# EAGLE design stimmopped (EAGLE 4.16)
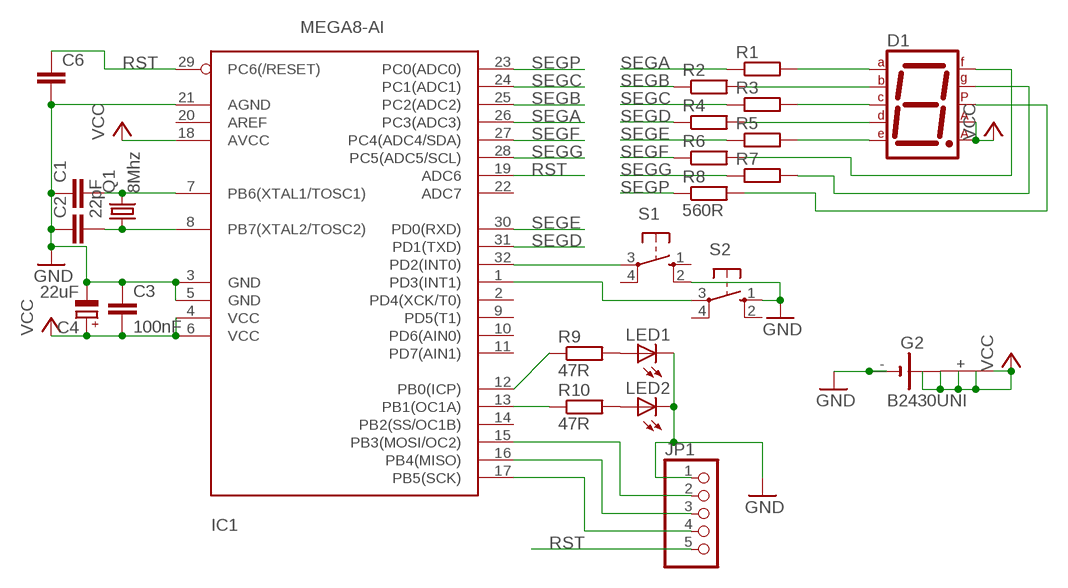
[diagram p0: schematic, sheet 1]

## Parts
C1  C-EUC0805K  [C0805K]
C2  22pF  C-EUC0805K  [C0805K]
C3  100nF  C-EUC0805K  [C0805K]
C4  22uF  CPOL-EUCT7343  [CT7343]
C6  C-EUC0805K  [C0805K]
D1  7SEG-MCA  [7SEG-7]
G2  B2430UNI  [B2430UNI]
IC1  MEGA8-AI  [TQFP32-08]
JP1  PINHD-1X5  [1X05]
LED1  LED5MM  [LED5MM]
LED2  LED5MM  [LED5MM]
Q1  8Mhz  CRYSTALHC49U-V  [HC49U-V]
R1  R-EU_R0805  [R0805]
R2  R-EU_R0805  [R0805]
R3  R-EU_R0805  [R0805]
R4  R-EU_R0805  [R0805]
R5  R-EU_R0805  [R0805]
R6  R-EU_R0805  [R0805]
R7  R-EU_R0805  [R0805]
R8  560R  R-EU_R0805  [R0805]
R9  47R  R-EU_R0805  [R0805]
R10  47R  R-EU_R0805  [R0805]
S1  10-XX  [B3F-10XX]
S2  10-XX  [B3F-10XX]

## Nets
GND: C1.1 C2.1 C3.1 C4.- C6.2 G2.- G2.-@1(-) IC1.3(GND) IC1.5(GND) IC1.21(AGND) JP1.1 LED1.K(C) LED2.K(C) S1.2(S1) S2.1(S)
N$1: D1.9(B) R2.2
N$2: C2.2 IC1.8(PB7(XTAL2/TOSC2)) Q1.1
N$3: C1.2 IC1.7(PB6(XTAL1/TOSC1)) Q1.2
N$6: D1.5(D) R4.2
N$8: D1.2(F) R6.2
N$9: D1.3(G) R7.2
N$10: D1.7(DP) R8.2
N$11: D1.10(A) R1.2
N$13: D1.8(C) R3.2
N$14: D1.4(E) R5.2
N$20: IC1.15(PB3(MOSI/OC2)) JP1.2
N$21: IC1.16(PB4(MISO)) JP1.3
N$22: IC1.17(PB5(SCK)) JP1.4
N$23: IC1.12(PB0(ICP)) R9.1
N$24: IC1.13(PB1(OC1A)) R10.1
N$25: IC1.32(PD2(INT0)) S1.3(P)
N$26: IC1.1(PD3(INT1)) S2.3(P)
N$28: LED1.A R9.2
N$29: LED2.A R10.2
RST: C6.1 IC1.19(ADC6) IC1.29(PC6(/RESET)) JP1.5
SEGA: IC1.26(PC3(ADC3)) R1.1
SEGB: IC1.25(PC2(ADC2)) R2.1
SEGC: IC1.24(PC1(ADC1)) R3.1
SEGD: IC1.31(PD1(TXD)) R4.1
SEGE: IC1.30(PD0(RXD)) R5.1
SEGF: IC1.27(PC4(ADC4/SDA)) R6.1
SEGG: IC1.28(PC5(ADC5/SCL)) R7.1
SEGP: IC1.23(PC0(ADC0)) R8.1
VCC: C3.2 C4.+ D1.1(CA1) D1.6(CA2) G2.+ G2.+@1(+) G2.+@2(+) G2.+@3(+) G2.+@4(+) IC1.4(VCC) IC1.6(VCC) IC1.18(AVCC)
Unconnected: IC1.2(PD4(XCK/T0)) IC1.9(PD5(T1)) IC1.10(PD6(AIN0)) IC1.11(PD7(AIN1)) IC1.14(PB2(SS/OC1B)) IC1.20(AREF) IC1.22(ADC7) S1.1(S) S1.4(P1) S2.2(S1) S2.4(P1)

## Library data of the parts
C1-C3 C6 = rcl:C-EU: CAPACITOR, European symbol
C4 = rcl:CPOL-EU: POLARIZED CAPACITOR, European symbol
D1 = special:7SEG-MCA: 7-segment DISPLAY single anode, 13 mm
G2 = battery:B2430UNI: LI BATTERY
IC1 = atmel:MEGA8: MICROCONTROLLER 8 Kbytes FLASH 1 kbytes SRAM 512 bytes EEPROM USART 6-channel 10 bit ADC 2-channel 8 bit ADC Source: avr.lbr
JP1 = pinhead:PINHD-1X5: PIN HEADER
LED1 LED2 = led:LED: LED OSRAM: - CHIPLED LG R971, LG N971, LY N971, LG Q971, LY Q971, LO R971, LY R971 LH N974, LH R974 LS Q976, LO Q976, LY Q976 LO Q996 - Hyper CHIPLED LW Q18S LB Q993, LB Q99A, LB R99A - SideLED LS A670, LO A670, LY A670, LG A670, LP A670 LB A673, LV A673, LT A673, LW A673 LH A674 LY A675 LS A676, LA A676, LO A676, LY A676, LW A676 LS A679, LY A679, LG A679 - Hyper Micro SIDELED® LS Y876, LA Y876, LO Y876, LY Y876 LT Y87S - SmartLED LW L88C, LW L88S LB L89C, LB L89S, LG L890 LS L89K, LO L89K, LY L89K LS L896, LA L896, LO L896, LY L896 - TOPLED LS T670, LO T670, LY T670, LG T670, LP T670 LSG T670, LSP T670, LSY T670, LOP T670, LYG T670 LG T671, LOG T671, LSG T671 LB T673, LV T673, LT T673, LW T673 LH T674 LS T676, LA T676, LO T676, LY T676, LB T676, LH T676, LSB T676, LW T676 LB T67C, LV T67C, LT T67C, LS T67K, LO T67K, LY T67K, LW E67C LS E67B, LA E67B, LO E67B, LY E67B, LB E67C, LV E67C, LT E67C LW T67C LS T679, LY T679, LG T679 LS T770, LO T770, LY T770, LG T770, LP T770 LB T773, LV T773, LT T773, LW T773 LH T774 LS E675, LA E675, LY E675, LS T675 LS T776, LA T776, LO T776, LY T776, LB T776 LHGB T686 LT T68C, LB T68C - Hyper Mini TOPLED® LB M676 - Mini TOPLED Santana® LG M470 LS M47K, LO M47K, LY M47K Source: http://www.osram.convergy.de - LUMILED® LXK2-PW12-R00, LXK2-PW12-S00, LXK2-PW14-U00, LXK2-PW14-V00 LXK2-PM12-R00, LXK2-PM12-S00, LXK2-PM14-U00 LXK2-PE12-Q00, LXK2-PE12-R00, LXK2-PE12-S00, LXK2-PE14-T00, LXK2-PE14-U00 LXK2-PB12-K00, LXK2-PB12-L00, LXK2-PB12-M00, LXK2-PB14-N00, LXK2-PB14-P00, LXK2-PB14-Q00 LXK2-PR12-L00, LXK2-PR12-M00, LXK2-PR14-Q00, LXK2-PR14-R00 LXK2-PD12-Q00, LXK2-PD12-R00, LXK2-PD12-S00 LXK2-PH12-R00, LXK2-PH12-S00 LXK2-PL12-P00, LXK2-PL12-Q00, LXK2-PL12-R00 Source: www.luxeon.com
Q1 = crystal:CRYSTAL: CRYSTAL
R1-R10 = rcl:R-EU_: RESISTOR, European symbol
S1 S2 = switch-omron:10-XX: OMRON SWITCH

## Board
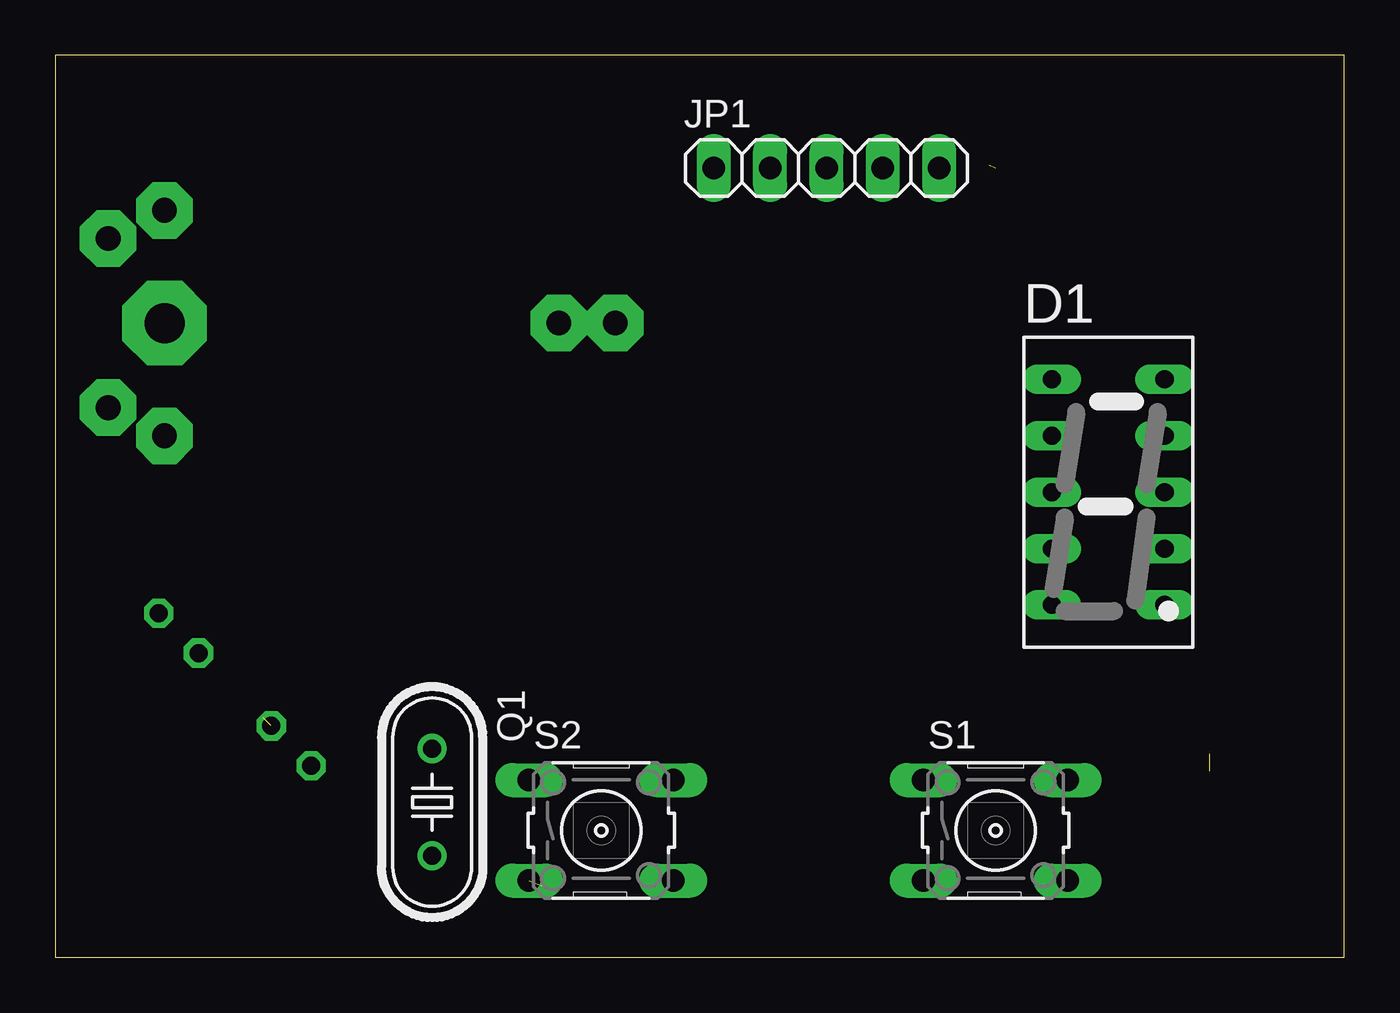
[diagram p1: board, top side]
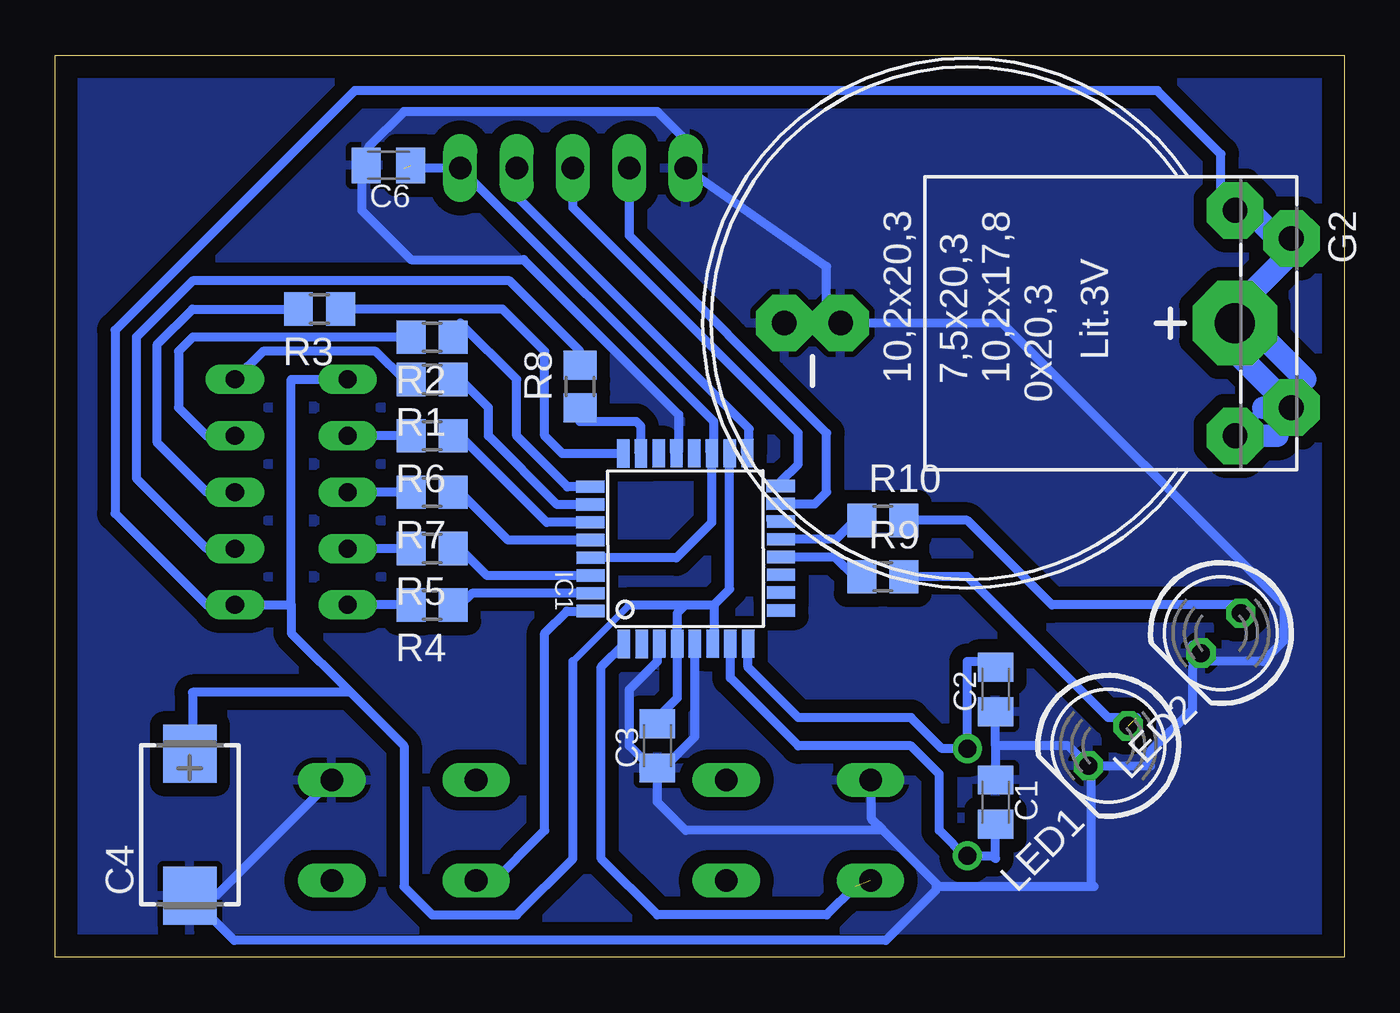
[diagram p2: board, bottom side, seen from below]

Size 58.09 x 40.63 mm. Coordinates in mm from the lower left corner, seen from the top.
Outline: 0,0 58.09,0 58.09,40.63 0,40.63 0,0
Copper layers (1*16): Top 0.035mm / dielectric 1.5mm / Bottom 0.035mm
Design rules "default": minimum track width 10mil, minimum drill 24mil, track to track 8mil, track to pad 8mil, pad to pad 8mil, via to via 8mil, smd to smd 8mil, copper to edge 40mil, drill to drill 8mil, minimum pad ring 10mil, minimum via ring 8mil, stop-mask expansion 4mil, vias tented up to drill 0mil, thermal gap 10mil

### Footprints (pad centres in the part's own frame; a part is rotated, then mirrored left to right if it is on the bottom)
C0805K = smd 1.3 x 1.6: 1 -1,0; 2 1,0
CT7343 = smd 2.6 x 2.4: + 3.2,0; - -3.2,0
7SEG-7 = drill 0.813 long: 1 -2.54,5.08; 2 -2.54,2.54; 3 -2.54,0; 4 -2.54,-2.54; 5 -2.54,-5.08; 6 2.54,-5.08; 7 2.54,-2.54; 8 2.54,0; 9 2.54,2.54; 10 2.54,5.08
B2430UNI = drill 1.118 pad 2.54 octagon: + 3.81,14.605; +@1 -3.81,14.605; +@2 -5.08,12.065; +@3 5.08,12.065; - 0,-5.715; -@1 0,-8.255 | drill 1.803 pad 3.81 octagon: +@4 0,12.065
TQFP32-08 = smd 1.27 x 0.559: 1 -4.293,2.8; 2 -4.293,2; 3 -4.293,1.2; 4 -4.293,0.4; 5 -4.293,-0.4; 6 -4.293,-1.2; 7 -4.293,-2; 8 -4.293,-2.8; 17 4.293,-2.8; 18 4.293,-2; 19 4.293,-1.2; 20 4.293,-0.4; 21 4.293,0.4; 22 4.293,1.2; 23 4.293,2; 24 4.293,2.8 | smd 0.559 x 1.27: 9 -2.8,-4.293; 10 -2,-4.293; 11 -1.2,-4.293; 12 -0.4,-4.293; 13 0.4,-4.293; 14 1.2,-4.293; 15 2,-4.293; 16 2.8,-4.293; 25 2.8,4.293; 26 2,4.293; 27 1.2,4.293; 28 0.4,4.293; 29 -0.4,4.293; 30 -1.2,4.293; 31 -2,4.293; 32 -2.8,4.293
1X05 = drill 1.016 long: 1 -5.08,0; 2 -2.54,0; 3 0,0; 4 2.54,0; 5 5.08,0
LED5MM = drill 0.813 octagon: A -1.27,0; K 1.27,0
HC49U-V = drill 0.813 round: 1 -2.413,0; 2 2.413,0
R0805 = smd 1.3 x 1.5: 1 -0.95,0; 2 0.95,0
B3F-10XX = drill 1.016 long: 1 -3.251,2.261; 2 3.251,2.261; 3 -3.251,-2.261; 4 3.251,-2.261

### Placement (x,y rotation side)
C1  15.71,6.98 270 bottom
C2  [C0805K]  15.71,12.06 90 bottom
C3  [C0805K]  30.95,9.52 90 bottom
C4  [CT7343]  52.03,5.96 90 bottom
C6  43.08,35.68 180 bottom
D1  47.46,20.95 0 top
G2  16.98,28.57 270 bottom
IC1  29.68,18.41 90.2 bottom
JP1  34.76,35.55 0 top
LED1  10.63,9.52 225 bottom
LED2  5.55,14.6 225 bottom
Q1  [HC49U-V]  16.98,6.98 270 top
R1  41.11,26.03 180 bottom
R2  41.11,27.93 179.9 bottom
R3  46.19,29.2 180 bottom
R4  41.11,15.87 180 bottom
R5  41.11,18.41 180 bottom
R6  41.11,23.49 180 bottom
R7  41.11,20.95 180 bottom
R8  [R0805]  34.44,25.71 90 bottom
R9  [R0805]  20.79,17.14 0 bottom
R10  [R0805]  20.79,19.68 0 bottom
S1  42.38,5.71 0 top
S2  24.6,5.71 0 top

### Tracks (layer width: path | path; a pad name or v marks a point on that pad's centre or on a via)
GND
  Bottom 0.406: IC1.3 30.95,14.03 30.95,13.33 32.22,12.06 32.22,9.52 30.95,8.25 | 30.95,8.25 C3.1 | IC1.5 29.27,9.94 30.95,8.25 | 15.71,9.52 C1.1 | 15.71,9.52 C2.1 | LED1.K 12.43,9.52 15.71,9.52 | 6.82,14.07 6.82,13.33 3.64,13.33 2.69,14.28 2.69,15.87 15.39,28.57 23.01,28.57 | 30.95,8.25 30.95,6.98 29.68,5.71 20.79,5.71 | 18.31,3.23 20.79,5.71 | 23.33,28.57 23.33,31.11 JP1.1 29.68,36.83 30.95,38.1 42.38,38.1 43.97,36.51 44.28,35.87 44.28,35.24 | 22.06,28.57 G2.- 23.01,28.57 | 23.33,28.57 G2.-@1 | 23.01,28.57 23.33,28.57 | LED1.K 8.73,8.62 8.73,9.27 6.82,11.17 6.82,13.08 6.44,13.46 6.45,13.47 LED2.K | 18.31,3.23 18.38,3.17 18.38,3.04 20.66,0.76 50.02,0.76 C4.- 52.06,2.79 | 18.31,3.23 18.25,3.17 11.27,3.17 11.39,3.3 11.39,8.5 11.41,8.5 LED1.K | 21.3,8.02 21.3,8.12 | 21.3,8.02 S2.1 | 20.79,5.71 21.3,6.22 21.3,8.02 | 52.06,2.79 52.16,2.79 | S1.2 50.81,2.79 52.06,2.79 | IC1.21 30,22.8 30,24.44 36.98,31.43 42.06,31.43 44.28,33.65 44.28,35.24 | 44.08,35.67 43.97,35.55 | 44.08,35.67 C6.2 | 44.28,35.24 44.08,35.67
  pour Bottom (isolate 0.61): 0.47,39.94 57.62,39.94 57.62,0.38 0.47,0.38
N$1
  Bottom 0.406: R2.2 51.9,27.94 52.54,27.3 52.54,24.76 51.27,23.49 D1.9
N$2
  Bottom 0.406: IC1.8 26.86,13.06 24.6,10.79 19.52,10.79 18.12,9.39 Q1.1 16.98,13.33 15.71,13.33 C2.2
N$3
  Bottom 0.406: IC1.7 27.66,12.59 24.6,9.52 19.52,9.52 18.25,8.25 18.25,5.71 16.98,4.44 Q1.2 15.84,4.57 15.71,4.44 C1.2
N$4
  pour Bottom (isolate 0.61): 0.6,39.94 57.75,39.94 57.75,0.25 0.6,0.25
N$6
  Bottom 0.406: R4.2 D1.5
N$8
  Bottom 0.406: R6.2 D1.2
N$9
  Bottom 0.406: R7.2 D1.3
N$10
  Bottom 0.406: D1.7 51.27,18.41 54.45,21.58 54.45,27.93 51.91,30.47 37.62,30.47 34.44,27.3 R8.2
N$11
  Bottom 0.406: R1.2 42.38,26.03 43.65,27.3 48.73,27.3 D1.10
N$13
  Bottom 0.406: R3.2 51.91,29.2 53.49,27.62 53.49,23.17 51.27,20.95 D1.8
N$14
  Bottom 0.406: R5.2 D1.4
N$20
  Bottom 0.406: IC1.15 23.86,20.43 23.33,20.95 23.33,23.62 32.22,32.51 JP1.2
N$21
  Bottom 0.406: IC1.16 25.4,21.42 24.6,22.22 24.6,23.62 34.76,33.78 JP1.3
N$22
  Bottom 0.406: IC1.17 26.82,22.79 26.82,23.81 37.3,34.29 JP1.4
N$23
  Bottom 0.406: R9.1 22.06,17.14 22.95,18.02 IC1.12
N$24
  Bottom 0.406: R10.1 22.06,19.68 22.91,18.82 IC1.13
N$25
  Bottom 0.406: IC1.32 35.03,15.6 36.03,14.6 36.03,5.71 38.57,3.17 39.84,3.17 39.56,3.45 S1.3
N$26  (1 unrouted)
  Bottom 0.406: IC1.1 33.49,13.08 33.49,4.44 30.95,1.9 23.33,1.9 22.06,3.17
N$28  (1 unrouted)
  Bottom 0.406: R9.2 16.98,17.14 10.63,10.79 9.36,10.79
N$29
  Bottom 0.406: R10.2 16.98,19.68 13.17,15.87 5.02,15.87 LED2.A
RST  (1 unrouted)
  Bottom 0.406: IC1.29 30.09,17.99 28.49,19.59 IC1.19 28.49,23.09 28.41,23.17 28.41,24.12 JP1.5 42.38,35.55
SEGA
  Bottom 0.406: IC1.26 35.48,20.39 38.57,23.49 38.57,24.76 39.84,26.03 R1.1
SEGB
  Bottom 0.406: IC1.25 35,21.2 37.3,23.49 37.3,26.03 39.84,28.57 R2.1
SEGC
  Bottom 0.406: IC1.24 35.23,22.69 36.03,23.49 36.03,27.3 37.94,29.2 R3.1
SEGD
  Bottom 0.406: R4.1 39.84,15.87 39.31,16.39 IC1.31
SEGE
  Bottom 0.406: R5.1 39.84,18.41 38.62,17.2 IC1.30
SEGF
  Bottom 0.406: R6.1 39.84,23.49 35.95,19.59 IC1.27
SEGG
  Bottom 0.406: R7.1 39.84,20.95 37.69,18.79 IC1.28
SEGP
  Bottom 0.406: IC1.23 31.7,23.92 31.9,24.12 34.44,24.12 R8.1
VCC  (1 unrouted)
  Bottom 0.305: 34.76,13.33 32.22,15.87
  Bottom 0.406: D1.1 47.46,26.03 47.46,15.87 | 47.46,15.87 D1.6 51.27,15.87 55.4,20 55.4,28.25 44.6,39.05 8.41,39.05 5.55,36.19 5.55,33.65 G2.+@2 4.28,33.65 | IC1.6 28.46,14.66 | 47.46,15.87 47.46,14.6 44.79,11.93 | 44.79,11.93 42.38,9.52 42.38,3.17 41.11,1.9 37.3,1.9 34.76,4.44 34.76,13.33 | IC1.4 30.06,14.99 | IC1.6 28.46,14.54 28.41,14.6 28.41,15.87 | 32.22,15.87 29.68,15.87 | 29.68,15.87 28.41,15.87 | IC1.4 30.06,15.49 29.68,15.87 | IC1.6 28.41,14.07 | C3.2 30.95,10.79 30.06,11.68 IC1.4 | 5.55,27.93 5.55,28.57 G2.+@4 4.28,28.57 | 1.74,26.03 1.74,24.76 3.01,23.49 | 5.55,23.49 G2.+@3 3.64,24.76 | 52.03,8.38 51.91,8.38 51.91,11.93 44.79,11.93 | IC1.18 27.7,16.59 28.41,15.87
  Bottom 1.016: 4.28,33.65 3.01,32.38 G2.+@1 1.74,32.38 5.55,28.57 | G2.+ 5.55,27.93 | 4.28,28.57 1.74,26.03 | 3.01,23.49 G2.+@3 | 1.74,24.76 3.64,24.76